# Altium schematic sheet STM32F030P4-DevBoard.SchDoc: STM32F030P4 DevBoard
size A4; CheckedBy: Felipe Navarro; Author: Felipe Navarro; DrawnBy: Felipe Navarro; Organization: Navarro Eletrônica; DocumentNumber: 1; Revision: 1.0; SheetNumber: 1; SheetTotal: 1; DocumentName: STM32F030P4 DevBoard; ProjectName: STM32F030P4 DevBoard
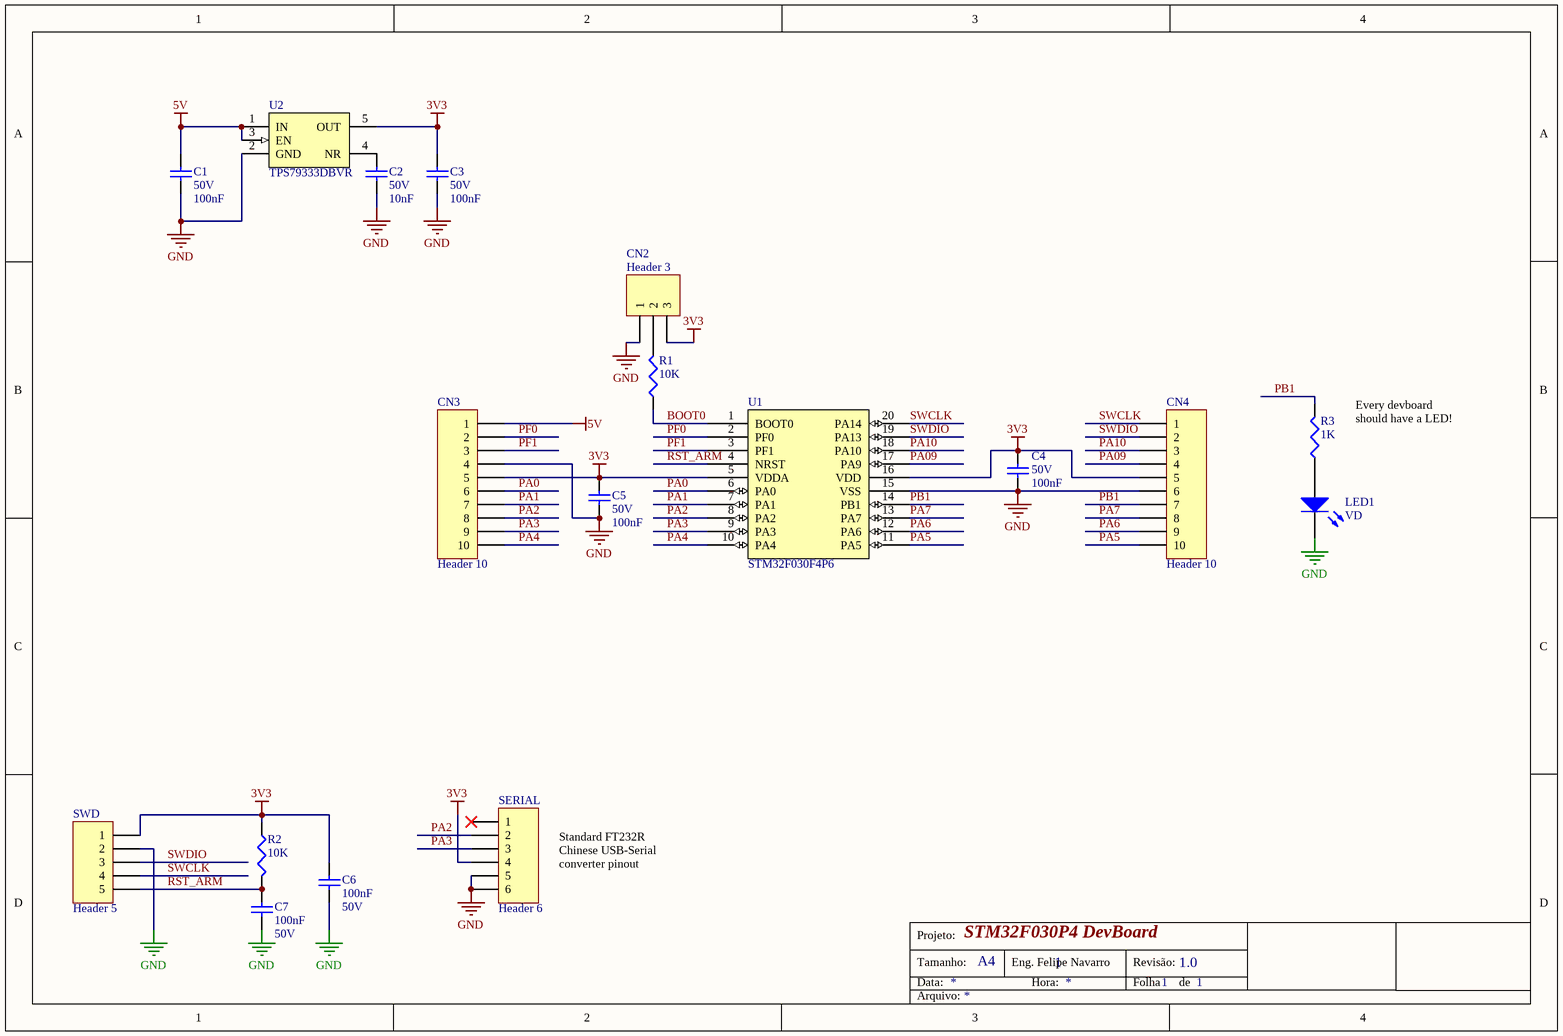
[diagram p0: STM32F030P4-DevBoard.SchDoc]

## Parts
C1  value 100nF  Tensão: 50V  [CC0603]  (hidden comment: Capacitor Cerâmico)
C2  value 10nF  Tensão: 50V  [CC0603]  (hidden comment: Capacitor Cerâmico)
C3  value 100nF  Tensão: 50V  [CC0603]  (hidden comment: Capacitor Cerâmico)
C4  value 100nF  Tensão: 50V  [CC0603]  (hidden comment: Capacitor Cerâmico)
C5  value 100nF  Tensão: 50V  [CC0603]  (hidden comment: Capacitor Cerâmico)
C6  value 100nF  Tensão: 50V  [CC0603]  (hidden comment: Capacitor Cerâmico)
C7  value 100nF  Tensão: 50V  [CC0603]  (hidden comment: Capacitor Cerâmico)
CN2  Header 3  [CONN HDR1X3]
CN3  Header 10  [CONN HDR1X10]
CN4  Header 10  [CONN HDR1X10]
LED1  value VD  [LED 0603]  (hidden comment: LED)
R1  value 10K  [CC0603]  (hidden comment: Resistor)
R2  value 10K  [CC0603]  (hidden comment: Resistor)
R3  value 1K  [CC0603]  (hidden comment: Resistor)
SERIAL  Header 6  [CONN HDR1X6]
SWD  Header 5  [CONN HDR1X5]
U1  STM32F030F4P6  [TSSOP-20N]
U2  TPS79333DBVR  [SOT-23-5N]

## Nets
3V3: C3.2 C4.2 C5.2 C6.2 CN2.3 CN3.5 CN4.5 R2.1 SERIAL.4 SWD.1 U1.5(VDDA) U1.16(VDD) U2.5(OUT)
5V: C1.2 CN3.1 U2.1(IN) U2.3(EN)
GND: C1.1 C2.1 C3.1 C4.1 C5.1 C6.1 C7.1 CN2.1 CN3.4 CN4.6 LED1.2(K) SERIAL.5 SERIAL.6 SWD.2 U1.15(VSS) U2.2(GND)
BOOT0: R1.1 U1.1(BOOT0)
PA0: CN3.6 U1.6(PA0)
PA1: CN3.7 U1.7(PA1)
PA2: CN3.8 SERIAL.2 U1.8(PA2)
PA3: CN3.9 SERIAL.3 U1.9(PA3)
PA4: CN3.10 U1.10(PA4)
PA5: CN4.10 U1.11(PA5)
PA6: CN4.9 U1.12(PA6)
PA7: CN4.8 U1.13(PA7)
PA09: CN4.4 U1.17(PA9)
PA10: CN4.3 U1.18(PA10)
PB1: CN4.7 R3.2 U1.14(PB1)
PF0: CN3.2 U1.2(PF0)
PF1: CN3.3 U1.3(PF1)
RST_ARM: C7.2 R2.2 SWD.5 U1.4(NRST)
SWCLK: CN4.1 SWD.4 U1.20(PA14)
SWDIO: CN4.2 SWD.3 U1.19(PA13)
NetC2_2: C2.2 U2.4(NR)
NetCN2_2: CN2.2 R1.2
NetLED1_1: LED1.1(A) R3.1

Not connected (* = marked no-connect by the designer): SERIAL 1*

## Notes on the sheet
- Every devboard should have a LED!
- Standard FT232R Chinese USB-Serial converter pinout
- Projeto:
- Tamanho:
- Data:
- A4
- Eng. Felipe Navarro
- Hora:
- Revisão:
- Folha
- de
- Arquivo:

## Library data of the parts
C1 C3-C5 = Cap 100nF 50V 0603 X7R: Capacitor (Semiconductor SIM Model); Chinês: Local; ChinesePrice: 0,00250; Corrente: *A; Potência: *W; Obs:: X7R; Tolerância: ±10%; Supplier 1: Digi-Key; Supplier Part Number 1: 1276-1000-1-ND; ComponentLink1Description: Datasheet; ComponentLink1URL: D:\Tecnoclade\Datasheet\!DataMissing.pdf
C2 = Cap 10nF 50V 0603 X7R 5%: Capacitor (Semiconductor SIM Model); Chinês: Local; ChinesePrice: 0,00320; Corrente: *A; Potência: *W; Obs:: X7R; Tolerância: ±5%; Supplier 1: Digi-Key; Supplier Part Number 1: 399-1092-1-ND; ComponentLink1Description: Datasheet; ComponentLink1URL: D:\Tecnoclade\Datasheet\!DataMissing.pdf
C6 C7 = Cap 100nF 50V 0603 X7R: Capacitor (Semiconductor SIM Model); ChinesePrice: 0,00000; Chinês: -----; Corrente: *A; Potência: *W; Obs:: X7R; Tolerância: ±10%; Supplier 1: Digi-Key; Supplier Part Number 1: 1276-1000-1-ND; ComponentLink1Description: Datasheet; ComponentLink1URL: D:\Tecnoclade\Datasheet\!DataMissing.pdf
CN2 = Header 3: Header, 3-Pin; ChinesePrice: 0,10000; Chinês: Proved - Local; Value: Barra de 40 pinos - ATENÇÃO; Corrente: *; Potência: *; Supplier 1: Digi-Key; Supplier Part Number 1: A26509-40-ND; Tensão: *; Obs:: *; Tolerância: *; ComponentLink1Description: Datasheet; ComponentLink1URL: D:\Tecnoclade\Datasheet\!DataMissing.pdf
CN3 CN4 = Header 10: Header, 10-Pin; ChinesePrice: 0,10000; Chinês: Proved - Local; Value: Barra de 40 pinos - ATENÇÃO; Corrente: *; Potência: *; Supplier 1: Digi-Key; Supplier Part Number 1: A26509-40-ND; Tensão: *; Obs:: *; Tolerância: *; ComponentLink1Description: Datasheet; ComponentLink1URL: D:\Tecnoclade\Datasheet\!DataMissing.pdf
LED1 = LED 0603 VD 2V 75mW: ChinesePrice: 0,02810; Chinês: Local; Corrente: 20mA; Potência: 75mW; Tensão: 2V; Obs:: 35mcd@130º; Supplier 1: Digi-Key; Supplier Part Number 1: 160-1478-1-ND; Tolerância: *; ComponentLink1Description: Datasheet; ComponentLink1URL: D:\Tecnoclade\Datasheet\!DataMissing.pdf
R1 = Res 10K 1% 0603 1/10W: ChinesePrice: 0,00089; Chinês: Local; Corrente: *A; Potência: 1/10W; Tensão: *V; Tolerância: ±1%; Supplier 1: Digi-Key; Supplier Part Number 1: P10.0KHCT-ND; Obs: *; ComponentLink1Description: Datasheet; ComponentLink1URL: D:\Tecnoclade\Datasheet\!DataMissing.pdf
R2 = Res 10K 1% 0603 1/10W: Potência: 1/10W; ChinesePrice: 0,00089; Chinês: Local; Corrente: *A; Tensão: *V; Tolerância: ±1%; Supplier 1: Digi-Key; Supplier Part Number 1: P10.0KHCT-ND; Obs: *; ComponentLink1Description: Datasheet; ComponentLink1URL: D:\Tecnoclade\Datasheet\!DataMissing.pdf
R3 = Res 1K 1% 0603 1/10W: ChinesePrice: 0,00089; Chinês: Local; Corrente: *A; Potência: 1/10W; Tensão: *V; Tolerância: ±1%; Supplier 1: Digi-Key; Supplier Part Number 1: RMCF0603FT1K00CT-ND; Obs: *; ComponentLink1Description: Datasheet; ComponentLink1URL: D:\Tecnoclade\Datasheet\!DataMissing.pdf
SERIAL = Header 6: Header, 6-Pin; ChinesePrice: 0,10000; Chinês: Proved - Local; Value: Barra de 40 pinos - ATENÇÃO; Corrente: *; Potência: *; Supplier 1: Digi-Key; Supplier Part Number 1: A26509-40-ND; Tensão: *; Obs:: *; Tolerância: *; ComponentLink1Description: Datasheet; ComponentLink1URL: D:\Tecnoclade\Datasheet\!DataMissing.pdf
SWD = Header 5: Header, 5-Pin; ChinesePrice: 0,10000; Chinês: Proved - Local; Value: Barra de 40 pinos - ATENÇÃO; Corrente: *; Potência: *; Supplier 1: Digi-Key; Supplier Part Number 1: A26509-40-ND; Tensão: *; Obs:: *; Tolerância: *; ComponentLink1Description: Datasheet; ComponentLink1URL: D:\Tecnoclade\Datasheet\!DataMissing.pdf
U1 = STM32F030F4P6: Microcontrolador STM32F030F4P6; ChinesePrice: 0,00000; Chinês: ----; Tensão: 1V8 ~ 3V6; Value: 32 bits; Corrente: *; Potência: *; Supplier 1: Digi-Key; Supplier Part Number 1: 497-14044-5-ND; Tolerância: *; ComponentLink1Description: Datasheet
U2 = TPS79333: ULTRALOW-NOISE, HIGH PSRR, FAST RF 200mA LOW-DROPOUT LINEAR  REGULATORS I; Tensão: 3V3; ChinesePrice: 0,00000; Chinês: ----; Corrente: 200mA; Potência: *; Supplier 1: Digi-Key; Supplier Part Number 1: 296-12961-1-ND; Value: *; Obs:: *; Tolerância: *; ComponentLink1Description: Datasheet; ComponentLink1URL: D:\Tecnoclade\Datasheet\